# Altium schematic sheet 03-power.SchDoc
size A4
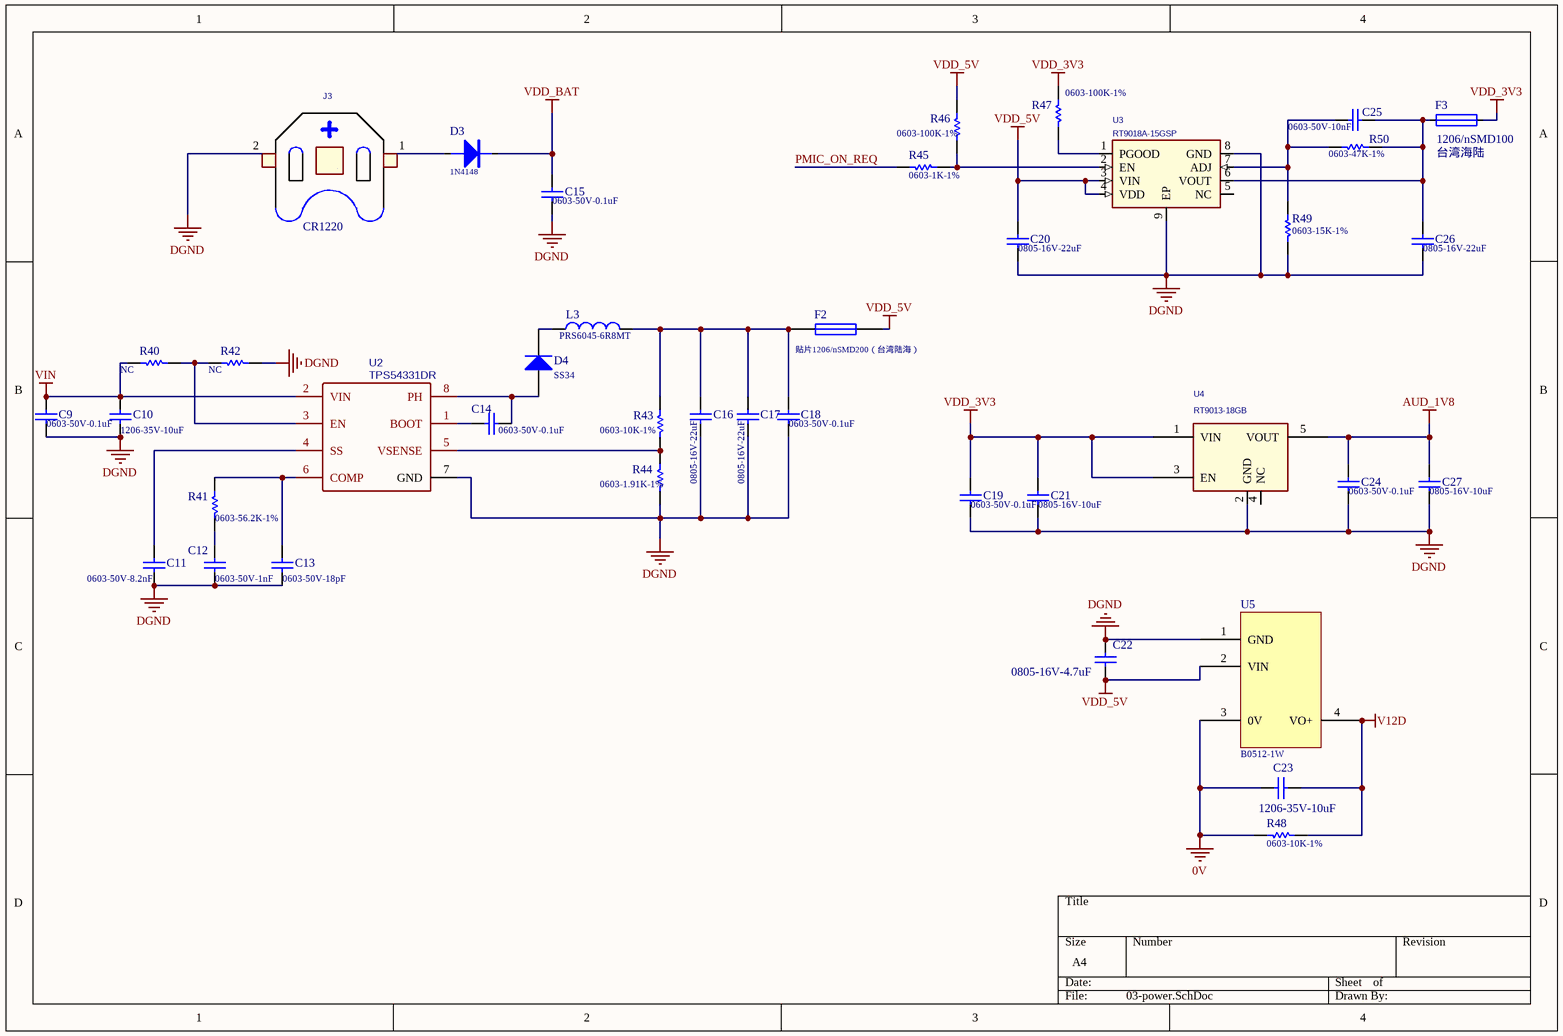
[diagram p0: 03-power.SchDoc]

## Parts
C9  0603-50V-0.1uF  [0603C]
C10  1206-35V-10uF  [1206C]
C11  0603-50V-8.2nF  [0603C]
C12  0603-50V-1nF  [0603C]
C13  0603-50V-18pF  [0603C]
C14  0603-50V-0.1uF  [0603C]
C15  0603-50V-0.1uF  [0603C]
C16  0805-16V-22uF  [0805C]
C17  0805-16V-22uF  [0805C]
C18  0603-50V-0.1uF  [0603C]
C19  0603-50V-0.1uF  [0603C]
C20  0805-16V-22uF  [0805C]
C21  0805-16V-10uF  [0805C]
C22  0805-16V-4.7uF  [1206C]
C23  1206-35V-10uF  [1206C]
C24  0603-50V-0.1uF  [0603C]
C25  0603-50V-10nF  [0603C]
C26  0805-16V-22uF  [0805C]
C27  0805-16V-10uF  [0805C]
D3  1N4148  [SOD-323]
D4  SS34  [SMA]
F2  贴片1206/nSMD200（台湾陆海）  [1206F]
F3  1206/nSMD100  厂家: 台湾海陆  [1206F]
J3  CR1220  [CR1220]
L3  PRS6045-6R8MT  [SCDS125T 12.5*12.5]
R40  NC  [0603R]
R41  0603-56.2K-1%  [0603R]
R42  NC  [0603R]
R43  0603-10K-1%  [0603R]
R44  0603-1.91K-1%  [0603R]
R45  0603-1K-1%  [0603R]
R46  0603-100K-1%  [0603R]
R47  0603-100K-1%  [0603R]
R48  0603-10K-1%  [0603R]
R49  0603-15K-1%  [0603R]
R50  0603-47K-1%  [0603R]
U2  TPS54331DR  [LC-SOIC-8_150mil]
U3  RT9018A-15GSP  [LC-SOP-8_EP_150mil]
U4  RT9013-18GB  [SOT-23-5]
U5  B0512-1W  [DIP-11.6X6.0X10.16]

## Nets
0V: C23.2 R48.1 U5.3(0V)
AUD_1V8: C24.1 C27.1 U4.5(VOUT)
DGND: C9.2 C10.2 C11.2 C12.2 C13.2 C15.2 C16.2 C17.2 C18.2 C19.2 C20.2 C21.2 C22.2 C24.2 C26.2 C27.2 J3.2(P2) R42.2 R44.2 R49.1 U2.7(GND) U3.8(GND) U3.9(EP) U4.2(GND) U5.1(GND)
V12D: C23.1 R48.2 U5.4(VO+)
VDD_3V3: C19.1 C21.1 F3.1 R47.1 U4.1(VIN) U4.3(EN)
VDD_5V: C20.1 C22.1 F2.2 R46.1 U3.3(VIN) U3.4(VDD) U5.2(VIN)
VDD_BAT: C15.1 D3.2
VIN: C9.1 C10.1 R40.1 U2.2(VIN)
PMIC_ON_REQ: R45.1
NetC11_1: C11.1 U2.4(SS)
NetC12_1: C12.1 R41.2
NetC13_1: C13.1 R41.1 U2.6(COMP)
NetC14_1: C14.1 D4.1(A) U2.8(PH)
NetC14_2: C14.2 U2.1(BOOT)
NetC16_1: C16.1 C17.1 C18.1 F2.1 L3.2 R43.1
NetC25_1: C25.1 R49.2 R50.1 U3.7(ADJ)
NetC25_2: C25.2 C26.1 F3.2 R50.2 U3.6(VOUT)
NetD3_1: D3.1 J3.1(P1)
NetD4_2: D4.2(K) L3.1
NetR40_2: R40.2 R42.1 U2.3(EN)
NetR43_2: R43.2 R44.1 U2.5(VSENSE)
NetR45_2: R45.2 R46.2 U3.2(EN)
NetR47_2: R47.2 U3.1(PGOOD)

Not connected (* = marked no-connect by the designer): U3 5(NC); U4 4(NC)

## Library data of the parts
C9-C21 C24-C27 = Cap: Capacitor; Value: 10nF; Published: 8-Jun-2000; Revision: July-2002: Re-released for DXP Platform.; Publisher: Altium Limited
C22 = Cap: Capacitor; Value: 2.2u; Published: 8-Jun-2000; LatestRevisionDate: 17-Jul-2002; LatestRevisionNote: Re-released for DXP Platform.; PackageReference: RAD-0.3; Publisher: Altium Limited; PackageDescription: Radial Cap, Thru-Hole; 2 Leads; 0.3 in Pin Spacing
C23 = Cap: Capacitor; Value: 4.7u; Published: 8-Jun-2000; LatestRevisionDate: 17-Jul-2002; LatestRevisionNote: Re-released for DXP Platform.; PackageReference: RAD-0.3; Publisher: Altium Limited; PackageDescription: Radial Cap, Thru-Hole; 2 Leads; 0.3 in Pin Spacing
D3 = DIODE
D4 = Diode BAS16: Silicon Switching Diode for High-Speed Switching; Note: Pin 2 is not connected and not drawn.; Published: 21-Mar-2003; LatestRevisionDate: 29-May-2009; LatestRevisionNote: IPC-7351 Footprint Added.; DatasheetVersion: Oct-1999; PackageVersion: Sep-2001; PackageReference: SOT-23; Publisher: Altium Limited; PackageDescription: 3-Pin SOT-23 Package 0.95 mm Pitch, 2.5 mm Lead Span; ComponentLink1Description: Manufacturer Link; ComponentLink1URL: http://www.infineon.com/; ComponentLink2Description: Datasheet; ComponentLink2URL: http://www.infineon.com/upload/Document/cmc_upload/documents/012/5331/bas16series.pdf
F2 F3 = Fuse 1: Fuse; Published: 8-Jun-2000; LatestRevisionDate: 17-Jul-2002; LatestRevisionNote: Re-released for DXP Platform.; PackageReference: PIN-W2/E2.8; Publisher: Altium Limited; PackageDescription: Thru-Hole; 2 Leads
J3 = BatteryHolder_1225: Connector,Battery Holder for 1225,Brown,SMD; Manufacturer: Leyconn; Manufacturer P/N: 469123330020; Myir P/N: 2111900002; Part Type: Connector; Reserve Value: CR1220; Datasheet: 469123-BatteryHolder_1225.pdf
L3 = Inductor: 贴片功率电感; Code_IEC: 1005; Published: 8-Jun-2000; LatestRevisionDate: 29-May-2009; LatestRevisionNote: IPC-7351 Footprint Added.; PackageReference: 0402-A; Publisher: Altium Limited; PackageDescription: Chip Inductor; Code_JEITA: 0402
R40 = Res1: Resistor; Value: 332K; Published: 8-Jun-2000; LatestRevisionDate: 17-Jul-2002; LatestRevisionNote: Re-released for DXP Platform.; PackageReference: AXIAL-0.3; Publisher: Altium Limited
R41 R43-R50 = Res1: Resistor; Value: 1K; Published: 8-Jun-2000; LatestRevisionDate: 17-Jul-2002; LatestRevisionNote: Re-released for DXP Platform.; PackageReference: AXIAL-0.3; Publisher: Altium Limited
R42 = Res1: Resistor; Value: 68.1K; Published: 8-Jun-2000; LatestRevisionDate: 17-Jul-2002; LatestRevisionNote: Re-released for DXP Platform.; PackageReference: AXIAL-0.3; Publisher: Altium Limited
U2 = (no symbol name): BOM_Manufacturer: TI; BOM_Supplier: LCSC; BOM_Manufacturer Part: TPS54331DR; BOM_LCSC Assembly: Yes; image: //image.lceda.cn/szlcsc/C9865.jpg; BOM_Supplier Part: C9865; spicePre: U
U3 = RT9018B: IC, Maximum 3A, Ultra Low Dropout Regulator 8SOP; Manufacturer: Richtek; Manufacturer P/N: RT9018A-18GSP; Myir P/N: 2010300061; Part Type: Power Management; Reserve Value: RT9018A-18GSP; Datasheet: RT9018.pdf
U4 = RT9013-18GB: IC, REG LDO 1.8V 0.5A SOT23-5; Manufacturer: Richtek; Myir P/N: 2010300012; Part Type: Power Management; Manufacturer P/N: RT9013-18GB; Reserve Value: RT9013-18GB; Datasheet: RT9013.pdf
U5 = F1212XT-1WR2: 隔离电源; 型号: B0512S-1W; 厂家: 清远市特斯拉电子科技有限公司; 替带产品: 金升阳  B0512S-1W